# EAGLE schematic galvo-schematic (EAGLE 9.3.0)
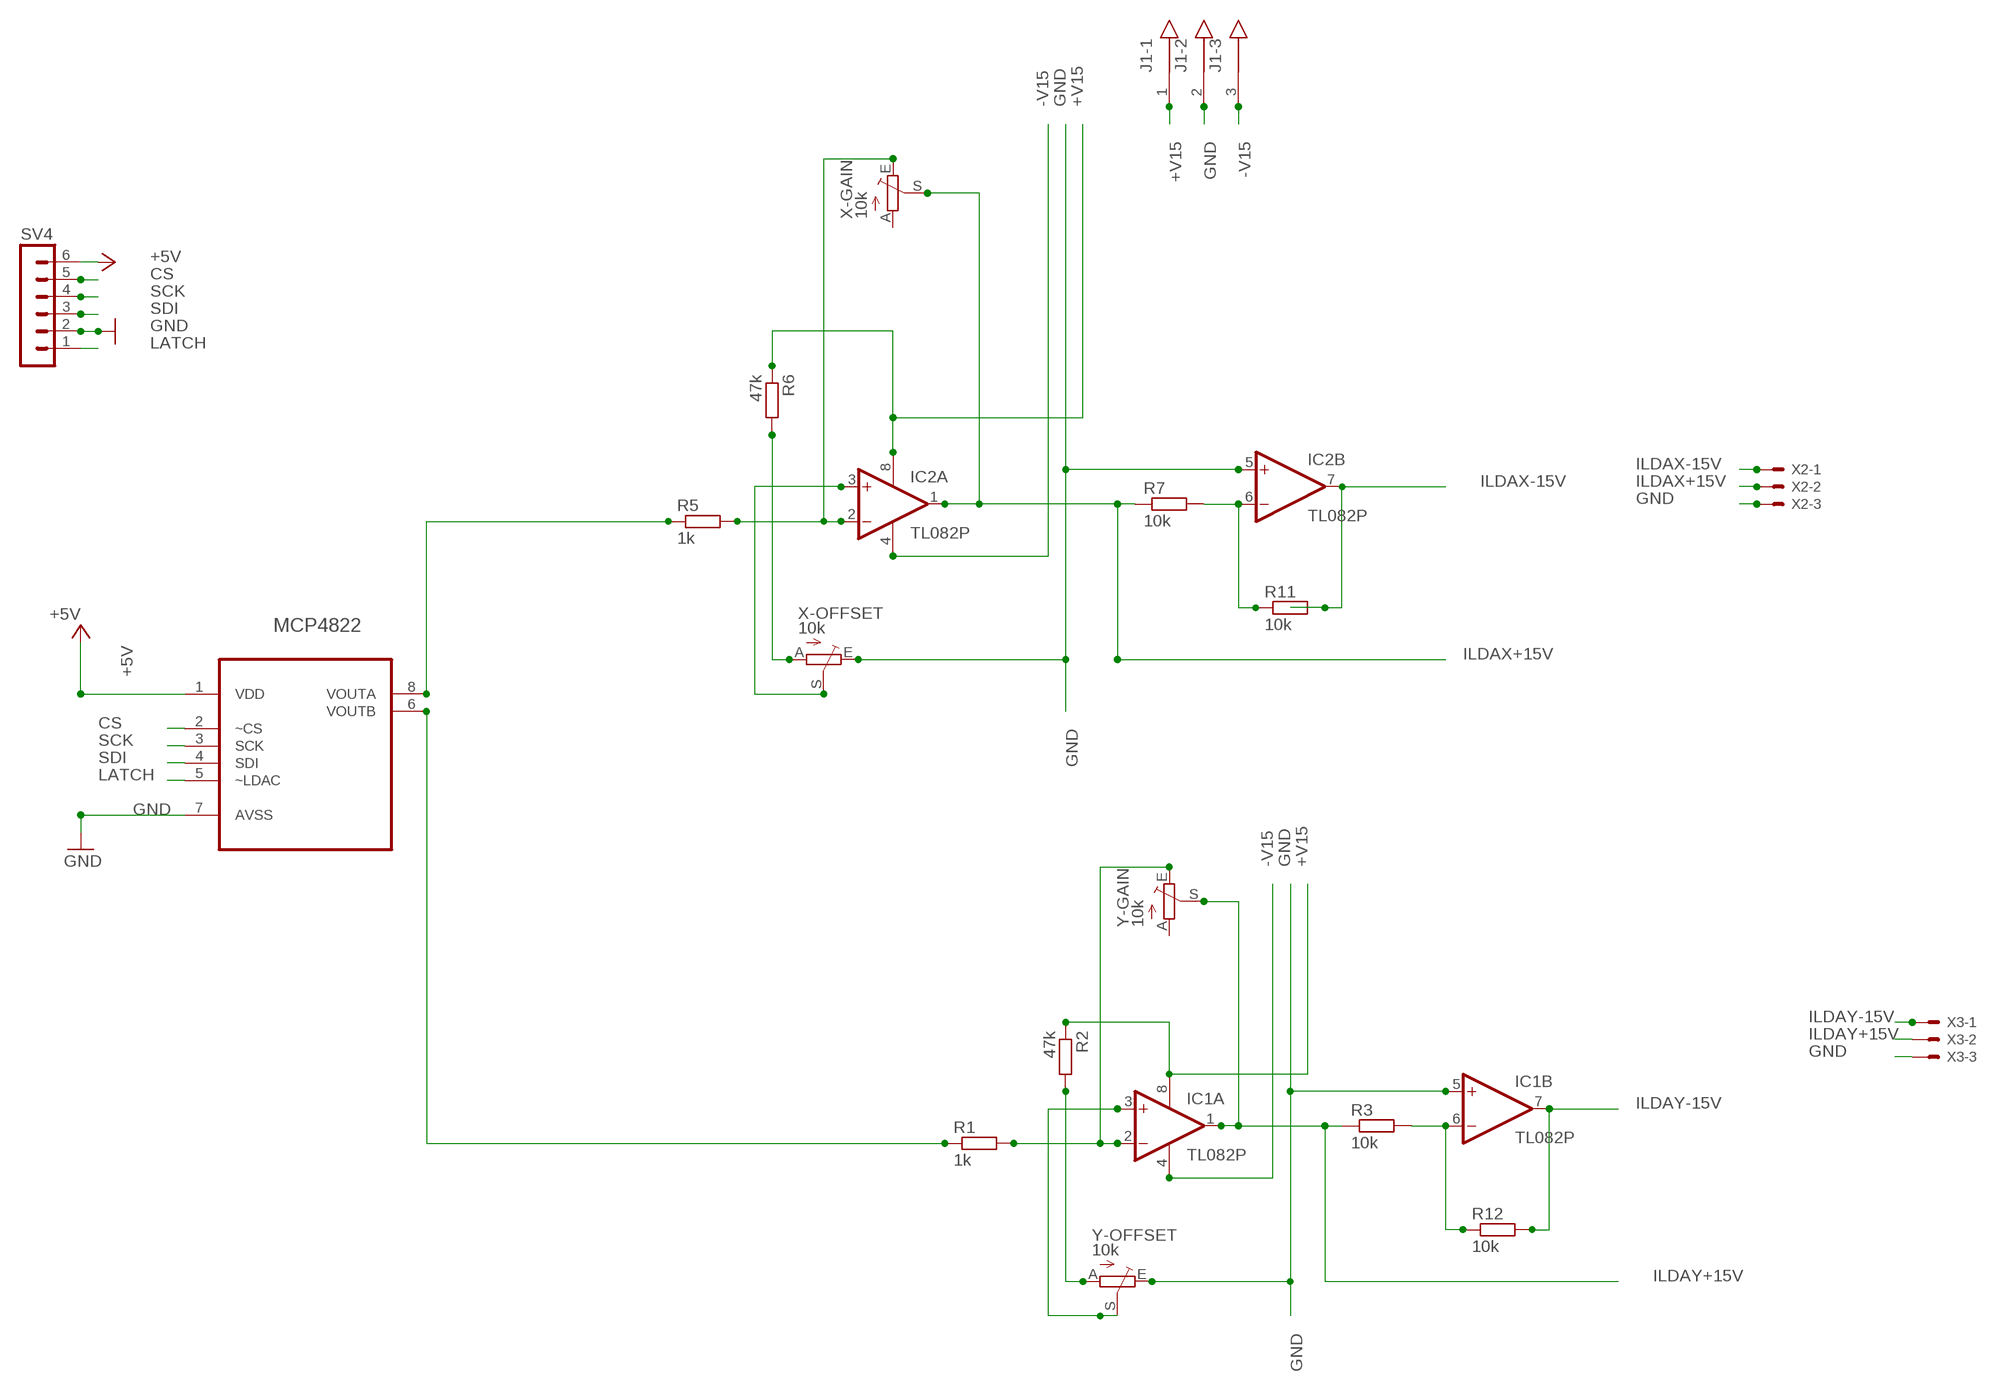
[diagram p0: schematic, sheet 1]

## Parts
IC1  TL082P  [DIL08]
IC2  TL082P  [DIL08]
J1  0022272031  [KK6410-2031_3-PIN]
MCP4822  MCP4822-E/P  [DIP254P762X432-8]
R1  1k  R-EU_0207/10  [0207/10]
R2  47k  R-EU_0207/10  [0207/10]
R3  10k  R-EU_0207/10  [0207/10]
R5  1k  R-EU_0207/10  [0207/10]
R6  47k  R-EU_0207/10  [0207/10]
R7  10k  R-EU_0207/10  [0207/10]
R11  10k  R-EU_0207/10  [0207/10]
R12  10k  R-EU_0207/10  [0207/10]
SV4  MA06-1  [MA06-1]
X2  JST-XH-03-PIN-ROUND-PAD  [JST-XH-03-PACKAGE-ROUND-PAD]
X3  JST-XH-03-PIN-ROUND-PAD  [JST-XH-03-PACKAGE-ROUND-PAD]
X-GAIN  10k  TRIM_EU-B25P  [B25P]
X-OFFSET  10k  TRIM_EU-B25P  [B25P]
Y-GAIN  10k  TRIM_EU-B25P  [B25P]
Y-OFFSET  10k  TRIM_EU-B25P  [B25P]

## Nets
+5V: MCP4822.1(VDD) SV4.6
+V15: IC1.8(P:V+) IC2.8(P:V+) J1.1 R2.1 R6.1
-V15: IC1.4(P:V-) IC2.4(P:V-) J1.3
CS: MCP4822.2(~CS) SV4.5
GND: IC1.5(B:+IN) IC2.5(B:+IN) J1.2 MCP4822.7(AVSS) SV4.2 X2.3 X3.3 X-OFFSET.E Y-OFFSET.E
ILDAX+15V: IC2.1(A:OUT) R7.1 X2.2 X-GAIN.S
ILDAX-15V: IC2.7(B:OUT) R11.2 X2.1
ILDAY+15V: IC1.1(A:OUT) R3.1 X3.2 Y-GAIN.S
ILDAY-15V: IC1.7(B:OUT) R12.2 X3.1
LATCH: MCP4822.5(~LDAC) SV4.1
N$1: IC1.6(B:-IN) R3.2 R12.1
N$3: R2.2 Y-OFFSET.A
N$4: IC2.6(B:-IN) R7.2 R11.1
N$5: IC1.3(A:+IN) Y-OFFSET.S
N$6: IC1.2(A:-IN) R1.2 Y-GAIN.E
N$8: MCP4822.6(VOUTB) R1.1
N$9: R6.2 X-OFFSET.A
N$10: IC2.2(A:-IN) R5.2 X-GAIN.E
N$12: IC2.3(A:+IN) X-OFFSET.S
N$15: MCP4822.8(VOUTA) R5.1
SCK: MCP4822.3(SCK) SV4.4
SDI: MCP4822.4(SDI) SV4.3
Unconnected: X-GAIN.A Y-GAIN.A

## Library data of the parts
IC1 IC2 = linear:TL082: OP AMP Data sheet <http://www.ti.com/lit/ds/symlink/tl084a . pdf>; DATA_SHEET: <a href="http://www.ti.com/lit/ds/symlink/tl084a.pdf"> Data sheet </a>
J1 = volks73-Molex:0022272031: KK® 254 Wire-to-Board Header, Vertical, with Friction Lock, 3 Circuits, Tin (Sn) Plating KK® Interconnect System Documentation Drawing <http://www.molex.com/pdm_docs/sd/022272031_sd.pdf> Product Specification <http://www.molex.com/pdm_docs/ps/PS-99020-0088.pdf>; COLOR: Natural; CONNECTOR_TYPE: Header, Unshrouded; CONTACT_FINISH: Tin; CONTACT_FINISH_THICKNESS: 100uin (2.54um); CONTACT_MATING_LENGTH: 0.295" (7.49mm); CONTACT_TYPE: Male Pin; DESCRIPTION: CONN HEADER 3POS .100 VERT TIN; DOCUMENTATION_LINK: <a href="http://www.molex.com/pdm_docs/sd/022272031_sd.pdf">Datasheet</a>; DOCUMENTATION_URL: http://www.molex.com/pdm_docs/sd/022272031_sd.pdf; FASTENING_TYPE: Friction Lock; FEATURES: -; MANUFACTURER: Molex Inc; MOUNTING_TYPE: Through Hole; NUMBER_OF_POSITIONS: 3; NUMBER_OF_POSITIONS_LOADED: All; NUMBER_OF_ROWS: 1; PART_NUMBER: 0022272031; PITCH: 0.100" (2.54mm); ROW_SPACING: -; SERIES: KK® 6410; SUPPLIER_ITEM_LINK: <a href="http://www.digikey.com/product-search/en?KeyWords=WM4112-ND&WT.z_header=search_go">Details</a>; SUPPLIER_ITEM_NUMBER: WM4112-ND; SUPPLIER_ITEM_URL: http://www.digikey.com/product-search/en?KeyWords=WM4112-ND&WT.z_header=search_go; SUPPLIER_LINK: <a href="http://www.digikey.com">Home Page</a>; SUPPLIER_NAME: Digi-Key; SUPPLIER_URL: http://www.digikey.com; TERMINATION: Solder
MCP4822 = Microchip_By_element14_Batch_1:MCP4822-E/P: DAC; MPN: MCP4822-E/P; OC_FARNELL: 1439413; OC_NEWARK: 11M1705; PACKAGE: DIP-8; SUPPLIER: Microchip
R1-R3 R5-R7 R11 R12 = resistor:R-EU_: RESISTOR, European symbol
SV4 = con-lstb:MA06-1: PIN HEADER; OC_FARNELL: unknown; OC_NEWARK: unknown
X2 X3 = Rembrandt Electronics - JST XH Connectors v1-0:JST-XH-03-PIN: JST XH Connector 2 Pin Wire to board connector. Pitch: 2,54 mm, (0.100") Number of pins: 3 Created by Rembrandt Electronics www.rembrandtelectronics.com
X-GAIN X-OFFSET Y-GAIN Y-OFFSET = pot:TRIM_EU-: POTENTIOMETER